# Altium schematic sheet S_R_Latch.SchDoc
size A
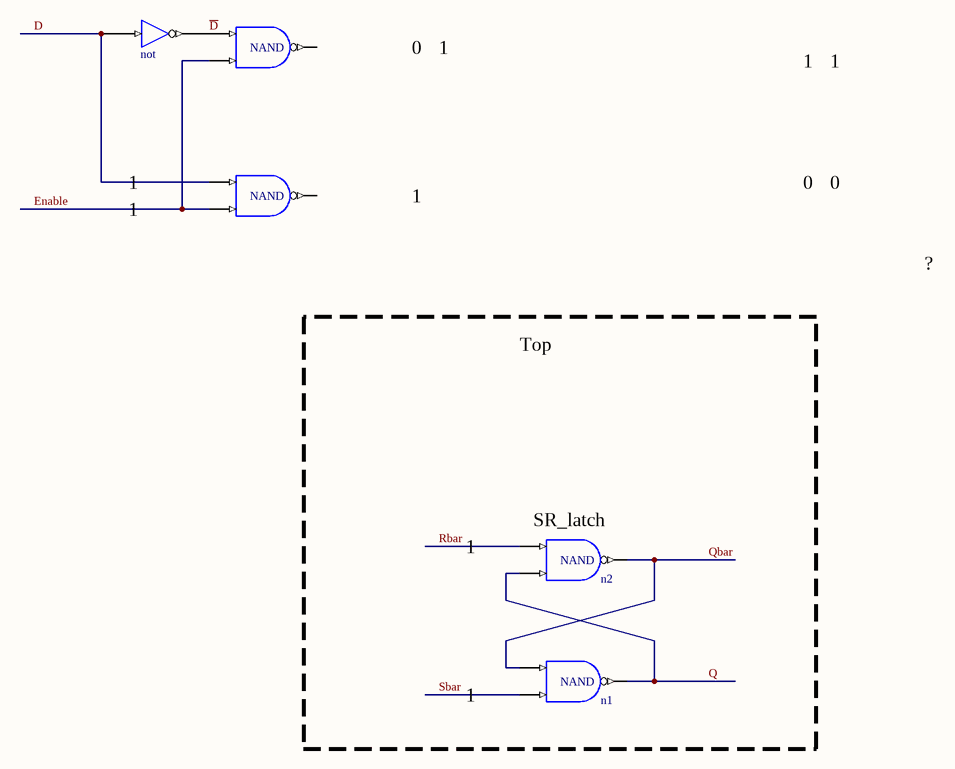
[diagram p0: S_R_Latch.SchDoc]

## Parts
(Parts that share a designator on the sheet are numbered #1, #2 ... from top to bottom, then left to right.)
n1  NAND
n2  NAND
U9#1  NAND
U9#2  NAND
U16  not

## Nets
D: U9#2.A U16.I
~{D}: U9#1.A U16.O
Enable: U9#1.B U9#2.B
Q: n1.Y n2.B
Qbar: n1.A n2.Y
Rbar: n2.A
Sbar: n1.B

Not connected (* = marked no-connect by the designer): U9#1 Y; U9#2 Y

## Notes on the sheet
- 0
- 1
- ?
- Top
- (near n2) SR_latch

## Library data of the parts
n1 n2 U9#1 U9#2 = AND: 2 Input AND
U16 = BUF: 1-bit General Purpose (Non-inverting) Buffer